# EAGLE design MoteinoM0_mic_v0.1 (EAGLE 9.6.2)
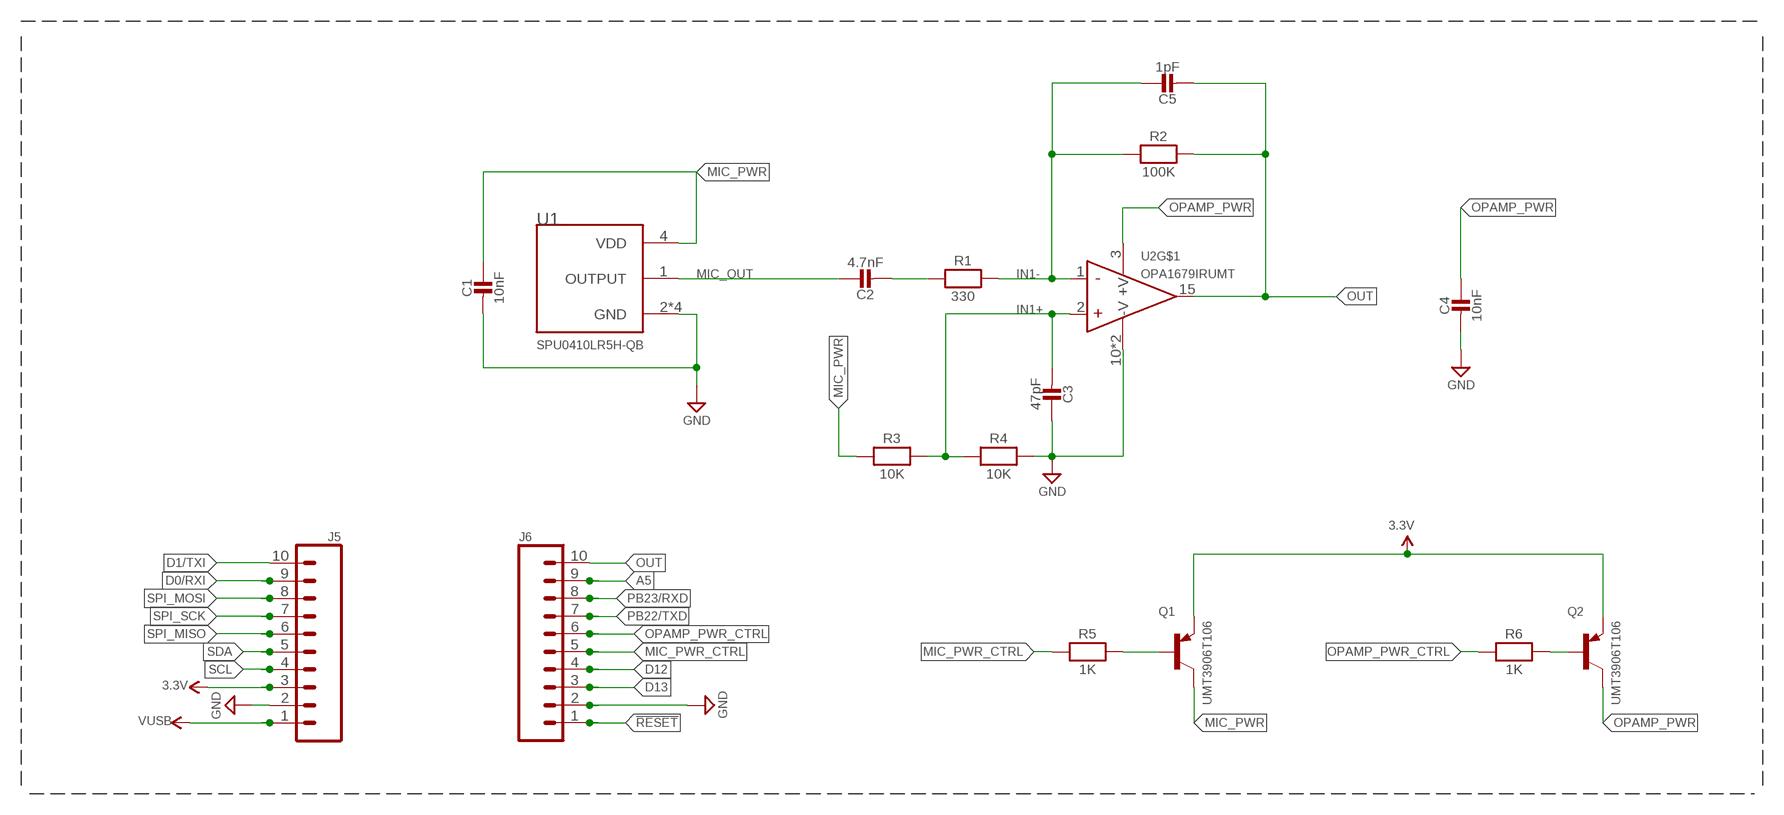
[diagram p0: schematic, sheet 1]

## Parts
C1  10nF  MICROBUILDER_CAP_CERAMIC_0402MP  [MICROBUILDER__0402MP]
C2  4.7nF  MICROBUILDER_CAP_CERAMIC_0402MP  [MICROBUILDER__0402MP]
C3  47pF  MICROBUILDER_CAP_CERAMIC_0402MP  [MICROBUILDER__0402MP]
C4  10nF  MICROBUILDER_CAP_CERAMIC_0402MP  [MICROBUILDER__0402MP]
C5  1pF  MICROBUILDER_CAP_CERAMIC_0402MP  [MICROBUILDER__0402MP]
J5  CONN_10NO_SILK_PTH_FEMALE  [1X10_NO_SILK]
J6  CONN_10NO_SILK_PTH_FEMALE  [1X10_NO_SILK]
Q1  UMT3906T106  [SOT65P210X100-3N-PNP]
Q2  UMT3906T106  [SOT65P210X100-3N-PNP]
R1  330  MICROBUILDER_RESISTOR_0402MP  [MICROBUILDER__0402MP]
R2  100K  MICROBUILDER_RESISTOR_0402MP  [MICROBUILDER__0402MP]
R3  10K  MICROBUILDER_RESISTOR_0402MP  [MICROBUILDER__0402MP]
R4  10K  MICROBUILDER_RESISTOR_0402MP  [MICROBUILDER__0402MP]
R5  1K  MICROBUILDER_RESISTOR_0402MP  [MICROBUILDER__0402MP]
R6  1K  MICROBUILDER_RESISTOR_0402MP  [MICROBUILDER__0402MP]
U1  SPU0410LR5H-QB  [XDCR_SPU0410LR5H-QB]
U2  OPA1679IRUMT  [QFN65P400X400X80-17N]

## Nets
3.3V: J5.3 Q1.1(E) Q2.1(E)
!RESET: J6.1
A5: J6.9
D0/RXI: J5.9
D1/TXI: J5.10
D12: J6.4
D13: J6.3
GND: C1.2 C3.1 C4.2 J5.2 J6.2 R4.2 U1.2(GND) U1.3(GND) U1.5(GND) U1.6(GND) U2.10(-V) U2.17(-V)
IN1+: C3.2 R3.2 R4.1 U2.2(+IN)
IN1-: C5.1 R1.2 R2.1 U2.1(-IN)
MIC_OUT: C2.1 U1.1(OUTPUT)
MIC_PWR: C1.1 Q1.3(C) R3.1 U1.4(VDD)
MIC_PWR_CTRL: J6.5 R5.1
N$1: Q1.2(B) R5.2
N$2: Q2.2(B) R6.2
N$4: C2.2 R1.1
OPAMP_PWR: C4.1 Q2.3(C) U2.3(+V)
OPAMP_PWR_CTRL: J6.6 R6.1
OUT: C5.2 J6.10 R2.2 U2.15(OUT)
PB22/TXD: J6.7
PB23/RXD: J6.8
SCL: J5.4
SDA: J5.5
SPI_MISO: J5.6
SPI_MOSI: J5.8
SPI_SCK: J5.7
VUSB: J5.1
Unconnected: U2.4(+IN) U2.5(-IN) U2.6(OUT) U2.7(OUT) U2.8(-IN) U2.9(+IN) U2.11(+IN) U2.12(-IN) U2.14(OUT)

## Library data of the parts
C1-C5 = Adafruit Feather 32u4 Bluefruit LE:MICROBUILDER_CAP_CERAMIC: Ceramic Capacitors For new designs, use the packages preceded by an '_' character since they are more reliable: The following footprints should be used on most boards: _0402 - Standard footprint for regular board layouts _0603 - Standard footprint for regular board layouts _0805 - Standard footprint for regular board layouts _1206 - Standard footprint for regular board layouts For extremely tight-pitch boards where space is at a premium, the following 'micro-pitch' footprints can be used (smaller pads, no silkscreen outline, etc.): _0402MP - Micro-pitch footprint for very dense/compact boards _0603MP - Micro-pitch footprint for very dense/compact boards _0805MP - Micro-pitch footprint for very dense/compact boards _1206MP - Micro-pitch footprint for very dense/compact boards; MPN: GRM155R71H104KE14J
J5 J6 = SparkFun-Connectors:CONN_10: Multi connection point. Often used as Generic Header-pin footprint for 0.1 inch spaced/style header connections On any of the 0.1 inch spaced packages, you can populate with these: Break Away Headers - Straight <https://www.sparkfun.com/products/116> (PRT-00116) Break Away Male Headers - Right Angle <https://www.sparkfun.com/products/553> (PRT-00553) Female Headers <https://www.sparkfun.com/products/115> (PRT-00115) Break Away Headers - Machine Pin <https://www.sparkfun.com/products/117> (PRT-00117) Break Away Female Headers - Swiss Machine Pin <https://www.sparkfun.com/products/743> (PRT-00743) Arduino Stackable Header - 10 Pin <https://www.sparkfun.com/products/11376> (PRT-11376) For SCREWTERMINALS and SPRING TERMINALS visit here: Screw Terimnals on SparkFun.com <https://www.sparkfun.com/search/results?term=Screw+Terminals> (5mm/3.5mm/2.54mm spacing) This device is also useful as a general connection point to wire up your design to another part of your project. Our various solder wires solder well into these plated through hole pads. Hook-Up Wire - Assortment (Stranded, 22 AWG) <https://www.sparkfun.com/products/11375> (PRT-11375) Hook-Up Wire - Assortment (Solid Core, 22 AWG) <https://www.sparkfun.com/products/11367> (PRT-11367) View the entire wire category on our website here <https://www.sparkfun.com/categories/141> Special notes: Molex polarized connector foot print use with SKU : PRT-08231 with associated crimp pins and housings. 1MM SMD Version SKU: PRT-10208 NOTES ON THE VARIANTS LOCK and LOCK_LONGPADS... This footprint was designed to help hold the alignment of a through-hole component (i.e. 6-pin header) while soldering it into place. You may notice that each hole has been shifted either up or down by 0.005 of an inch from it's more standard position (which is a perfectly straight line). This slight alteration caused the pins (the squares in the middle) to touch the edges of the holes. Because they are alternating, it causes a "brace" to hold the component in place. 0.005 has proven to be the perfect amount of "off-center" position when using our standard breakaway headers. Although looks a little odd when you look at the bare footprint, once you have a header in there, the alteration is very hard to notice. Also,if you push a header all the way into place, it is covered up entirely on the bottom side.; PROD_ID: CONN-11563
Q1 Q2 = UMT390X:UMT3906T106: ROHM: UMT3906T106 PNP BJT SC-70/SOT323-3
R1-R6 = Adafruit Feather 32u4 Bluefruit LE:MICROBUILDER_RESISTOR: Resistors For new designs, use the packages preceded by an '_' character since they are more reliable: The following footprints should be used on most boards: _0402 - Standard footprint for regular board layouts _0603 - Standard footprint for regular board layouts _0805 - Standard footprint for regular board layouts _1206 - Standard footprint for regular board layouts For extremely tight-pitch boards where space is at a premium, the following 'micro-pitch' footprints can be used (smaller pads, no silkscreen outline, etc.): _0402MP - Micro-pitch footprint for very dense/compact boards _0603MP - Micro-pitch footprint for very dense/compact boards _0805MP - Micro-pitch footprint for very dense/compact boards _1206MP - Micro-pitch footprint for very dense/compact boards; MPN: RC0402FR-074K7P
U1 = SPU0410LR5H-QB:SPU0410LR5H-QB: 100Hz ~ 80kHz Analog Microphone MEMS (Silicon) 1.5V ~ 3.6V Omnidirectional (-38dB ±3dB @ 94dB SPL), SMD Check availability <https://pricing.snapeda.com/parts/SPU0410LR5H-QB/Knowles/view-part?ref=eda>; AVAILABILITY: In Stock; DESCRIPTION: 100 Hz ~ 80 kHz Analog Microphone MEMS (Silicon) 1.5 V ~ 3.6 V Omnidirectional (-38dB ±3dB @ 94dB SPL) Solder Pads; MF: Knowles; MP: SPU0410LR5H-QB; PACKAGE: None; PRICE: None; PURCHASE-URL: https://pricing.snapeda.com/search/part/SPU0410LR5H-QB/?ref=eda
U2 = OPA1679IRUMT:OPA1679IRUMT

## Net classes
1 power: width 0.381 mm, clearance 0.254 mm

## Board
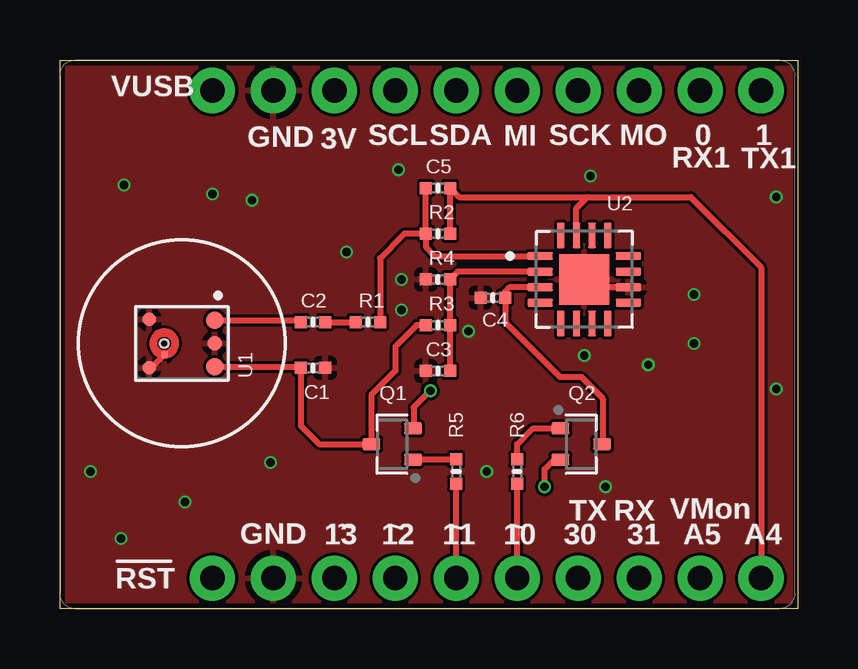
[diagram p1: board, top side]
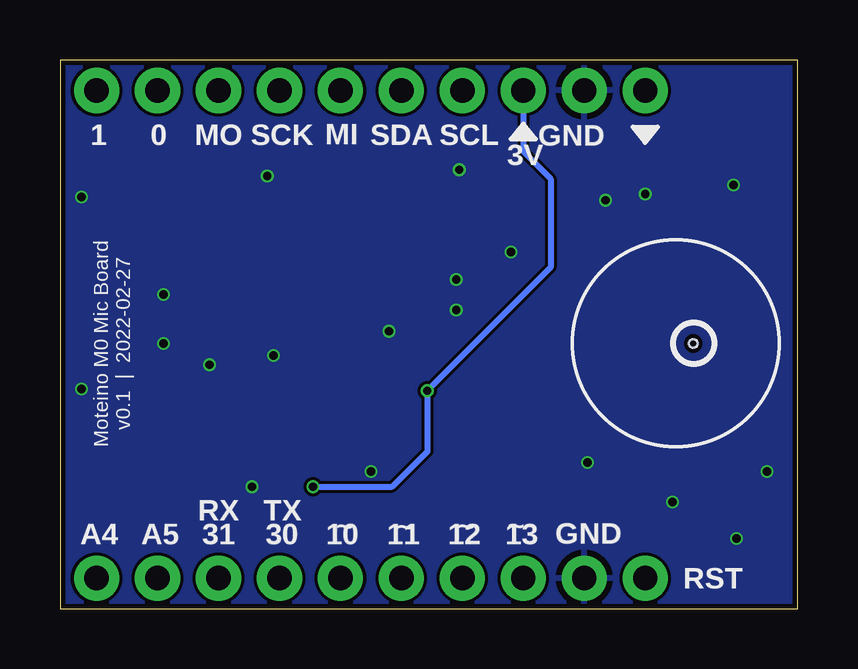
[diagram p2: board, bottom side, seen from below]

Size 30.73 x 22.86 mm. Coordinates in mm from the lower left corner, seen from the top.
Outline: 0,0 0,22.86 30.73,22.86 30.73,0 0,0
Copper layers (1*16): Top 0.035559375mm / dielectric 1.6mm / Bottom 0.035559375mm
Design rules "jlcpcb2layer *": minimum track width 5mil, minimum drill 12mil, track to track 5mil, track to pad 5mil, pad to pad 5mil, via to via 5mil, smd to smd 5mil, copper to edge 8mil, drill to drill 6mil, minimum pad ring 5mil, minimum via ring 3mil, stop-mask expansion 2.5mil, vias tented up to drill 14mil, thermal gap 10mil

### Footprints (pad centres in the part's own frame; a part is rotated, then mirrored left to right if it is on the bottom)
MICROBUILDER__0402MP = smd 0.5 x 0.5: 1 -0.508,0; 2 0.508,0
1X10_NO_SILK = drill 1.016 pad 1.88: 1 0,0; 2 2.54,0; 3 5.08,0; 4 7.62,0; 5 10.16,0; 6 12.7,0; 7 15.24,0; 8 17.78,0; 9 20.32,0; 10 22.86,0
SOT65P210X100-3N-PNP = smd 0.75 x 0.5: 1 -0.87,-0.65; 2 -0.87,0.65; 3 0.87,0
XDCR_SPU0410LR5H-QB = smd 0.723 x 0.723: 1 -0.966,1.369; 4 0.966,1.369 | smd 0.562 x 0.562: 2 -1.015,-1.369; 3 1.015,-1.369 | smd 0.612 x 0.612: 5 0,1.369 | smd 0.25 x 0.25: 6 0.47,-0.74 | hole 0.35: 0,-0.735
QFN65P400X400X80-17N = smd 1.06 x 0.32: 1 -1.835,0.975; 2 -1.835,0.325; 3 -1.835,-0.325; 4 -1.835,-0.975; 9 1.835,-0.975; 10 1.835,-0.325; 11 1.835,0.325; 12 1.835,0.975 | smd 0.32 x 1.06: 5 -0.975,-1.835; 6 -0.325,-1.835; 7 0.325,-1.835; 8 0.975,-1.835; 13 0.975,1.835; 14 0.325,1.835; 15 -0.325,1.835; 16 -0.975,1.835 | smd 2.1 x 2.1: 17 0,0

### Placement (x,y rotation side)
C1  10.54,10.03 0 top
C2  10.54,11.94 0 top
C3  15.75,9.91 0 top
C4  18.03,12.95 180 top
C5  15.75,17.53 0 top
J5  6.35,21.59 0 top
J6  6.35,1.27 0 top
Q1  13.84,6.86 180 top
Q2  21.72,6.86 0 top
R1  12.83,11.94 0 top
R2  15.75,15.62 0 top
R3  15.75,11.81 0 top
R4  15.75,13.72 180 top
R5  16.51,5.71 90 top
R6  19.05,5.71 90 top
U1  5.08,11.05 270 top
U2  21.84,13.72 0 top

### Tracks (layer width: path | path; a pad name or v marks a point on that pad's centre or on a via)
3.3V  (via drill 0.35)
  Top 0.254: v20.19,5.08 20.19,5.81 20.59,6.21 Q2.1 | v15.43,9.08 14.73,8.38 14.73,7.53 Q1.1
  Bottom 0.254: J5.3 11.43,19.05 10.29,17.91 10.29,14.22 v15.43,9.08 15.43,6.54 16.89,5.08 v20.19,5.08
GND  (via drill 0.35)
  Top 0.254: U2.10 22.17,13.39 U2.17 | U1.6 3.79,10.03 U1.3
  other vias: 6.35,17.27 5.21,4.45 26.42,11.05 26.42,13.08 17.02,11.56 14.22,13.72 8,17.02 2.67,17.65 1.27,5.71 2.54,2.92 8.76,6.1 29.84,17.14 22.1,18.03 24.51,10.16 22.73,5.08 17.78,5.71 14.1,18.29 11.94,14.86 21.84,10.54 29.84,9.14 14.22,12.45
  pour Bottom: 0.13,22.73 0.13,0.08 30.61,0 30.61,22.73
  pour Top: -0.13,22.99 -0.13,-0.18 30.86,-0.26 30.86,22.99
IN1+
  Top 0.254: U2.2 16.58,14.04 R4.1 R3.2 C3.2
IN1-
  Top 0.254: R2.1 15.24,15.07 15.62,14.69 U2.1 | R2.1 14.35,15.62 13.34,14.61 R1.2 | R2.1 C5.1
MIC_OUT
  Top 0.254: U1.1 9.96,12.01 C2.1
MIC_PWR
  Top 0.254: U1.4 9.98,10.08 C1.1 10.03,7.62 10.79,6.86 Q1.3 12.97,8.91 13.97,9.91 13.97,10.92 14.86,11.81 R3.1
MIC_PWR_CTRL
  Top 0.254: J6.5 R5.1
N$1
  Top 0.254: R5.2 16.5,6.21 Q1.2
N$2
  Top 0.254: R6.2 19.05,6.86 19.7,7.51 Q2.2
N$4
  Top 0.254: C2.2 R1.1
OPAMP_PWR
  Top 0.254: U2.3 18.73,13.39 18.54,13.21 C4.1 18.54,11.94 20.83,9.65 21.72,9.65 22.61,8.76 22.61,6.88 Q2.3
OPAMP_PWR_CTRL
  Top 0.254: J6.6 R6.1
OUT
  Top 0.254: R2.2 C5.2 16.64,17.14 21.97,17.14 | 21.97,17.14 21.52,16.69 U2.15 | 21.97,17.14 26.29,17.14 29.21,14.22 J6.10

### Text on the board
tPlace: VUSB | GND | 3V | SCL | SDA | MI | SCK | MO | 0 | 1 | RX1 | TX1 | ~ | ~ | ~ | ~ | TX | RX | VMon | GND | 13 | 12 | 11 | 10 | 30 | 31 | A5 | A4 | RST
bPlace: GND | SCL | SDA | MI | SCK | MO | 0 | 1 | 3V | Moteino M0 Mic Board / v0.1 | 2022-02-27 | TX | RX | GND | 13 | ~ | ~ | 12 | ~ | 11 | ~ | 10 | 30 | 31 | A5 | A4 | RST